# EAGLE design Spring2020 (EAGLE 9.6.2)
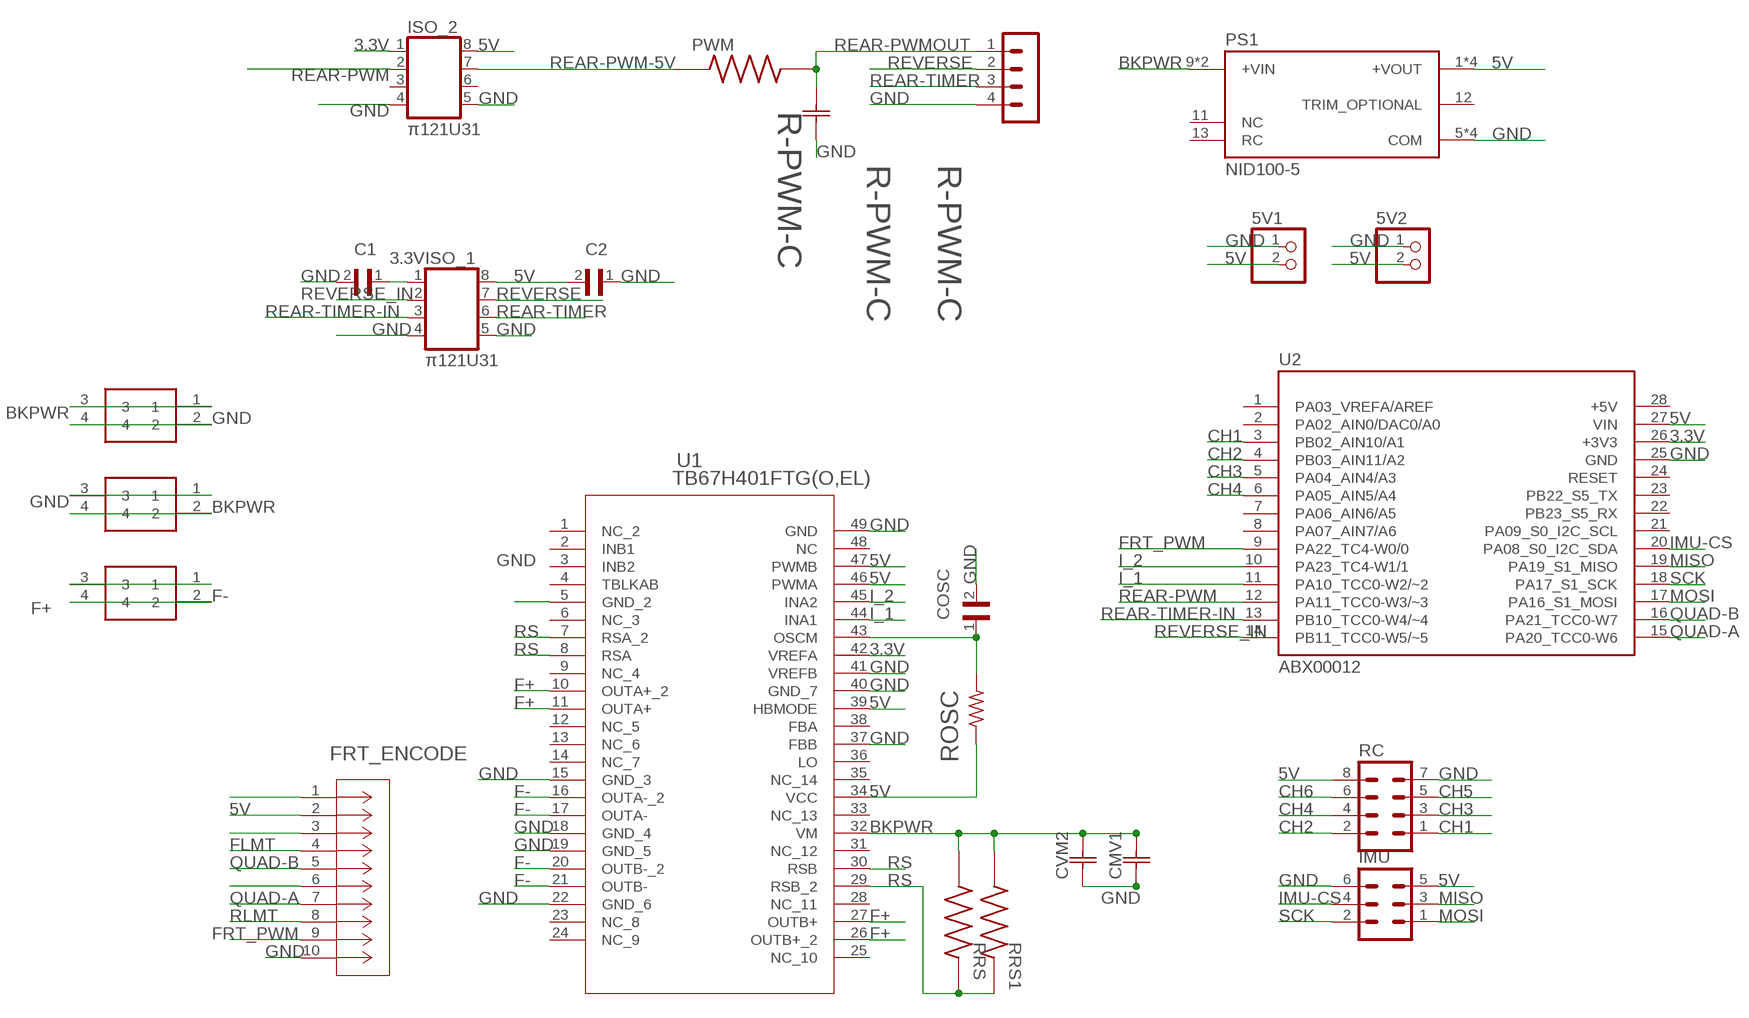
[diagram p0: schematic, sheet 1]

## Parts
5V1  PINHD-1X2  [1X02]
5V2  PINHD-1X2  [1X02]
C1  CL05A105KP5NNNC  [CAPC1005X55N]
C2  CL05A105KP5NNNC  [CAPC1005X55N]
CMV1  UVY1H102MHD  [CAP_12.5_X_25_NCH]
COSC  GRM022R71A271KA01L  [CAPC0402X22N]
CVM2  CL05B104KB54PNC  [CAP_CL_05_SAM]
FRT_ENCODE  3220-10-0100-00  [CONN_3220-10-0100-00_CNC]
FRT_MTR  2060-452_998-404  [2060452998404]
IMU  MA03-2  [MA03-2]
ISO_1  π121U31  [SO08]
ISO_2  π121U31  [SO08]
PS1  NID100-5  [CONV_NID100-5]
PWM  ERJ1GNF6802C  [RES_ERJ1GNF6802C]
PWR_IN  2060-452_998-404  [2060452998404]
R-PWM-C  CL03A105MQ3CSNC  [CAP_CL03_SAM]
RC  MA04-2  [MA04-2]
REAR-MOTOR  MA04-1  [MA04-1]
REAR_PWR  2060-452_998-404  [2060452998404]
ROSC  R-US_R0402  [R0402]
RRS  RLP73K3AR22FTDF  [RESC6331X70N]
RRS1  RLP73K3AR22FTDF  [RESC6331X70N]
U1  TB67H401FTG(O,EL)  [P-VQFN48-0707-0P50-004_TOS]
U2  ABX00012  [ARDUINO_ABX00012]

## Nets
3.3V: C1.1 ISO_1.1 ISO_2.1 U1.42(VREFA) U2.26(+3V3)
5V: 5V1.2 5V2.2 C2.2 FRT_ENCODE.2 IMU.5 ISO_1.8 ISO_2.8 PS1.1(+VOUT) PS1.2(+VOUT) PS1.3(+VOUT) PS1.4(+VOUT) RC.8 ROSC.1 U1.34(VCC) U1.39(HBMODE) U1.46(PWMA) U1.47(PWMB) U2.27(VIN)
BKPWR: CMV1.2 CVM2.2 PS1.9(+VIN) PS1.10(+VIN) PWR_IN.1 PWR_IN.3 REAR_PWR.2 REAR_PWR.4 RRS1.1 RRS.1 U1.32(VM)
CH1: RC.1 U2.3(PB02_AIN10/A1)
CH2: RC.2 U2.4(PB03_AIN11/A2)
CH3: RC.3 U2.5(PA04_AIN4/A3)
CH4: RC.4 U2.6(PA05_AIN5/A4)
CH5: RC.5
CH6: RC.6
F+: FRT_MTR.2 FRT_MTR.4 U1.10(OUTA+_2) U1.11(OUTA+) U1.26(OUTB+_2) U1.27(OUTB+)
F-: FRT_MTR.1 FRT_MTR.3 U1.16(OUTA-_2) U1.17(OUTA-) U1.20(OUTB-_2) U1.21(OUTB-)
FLMT: FRT_ENCODE.4
FRT_PWM: FRT_ENCODE.9 U2.9(PA22_TC4-W0/0)
GND: 5V1.1 5V2.1 C1.2 C2.1 CMV1.1 COSC.2 CVM2.1 FRT_ENCODE.10 IMU.6 ISO_1.4 ISO_1.5 ISO_2.4 ISO_2.5 PS1.5(COM) PS1.6(COM) PS1.7(COM) PS1.8(COM) PWR_IN.2 PWR_IN.4 R-PWM-C.2 RC.7 REAR-MOTOR.4 REAR_PWR.1 REAR_PWR.3 U1.5(GND_2) U1.15(GND_3) U1.18(GND_4) U1.19(GND_5) U1.22(GND_6) U1.37(FBB) U1.40(GND_7) U1.41(VREFB) U1.49(GND) U2.25(GND)
I_1: U1.44(INA1) U2.11(PA10_TCC0-W2/~2)
I_2: U1.45(INA2) U2.10(PA23_TC4-W1/1)
IMU-CS: IMU.4 U2.20(PA08_S0_I2C_SDA)
MISO: IMU.3 U2.19(PA19_S1_MISO)
MOSI: IMU.1 U2.17(PA16_S1_MOSI)
N$1: FRT_ENCODE.3
N$2: FRT_ENCODE.1
N$8: FRT_ENCODE.6
OSCM: COSC.1 ROSC.2 U1.43(OSCM)
QUAD-A: FRT_ENCODE.7 U2.15(PA20_TCC0-W6)
QUAD-B: FRT_ENCODE.5 U2.16(PA21_TCC0-W7)
REAR-PWM: ISO_2.2 U2.12(PA11_TCC0-W3/~3)
REAR-PWM-5V: ISO_2.7 PWM.1
REAR-PWMOUT: PWM.2 R-PWM-C.1 REAR-MOTOR.1
REAR-TIMER: ISO_1.6 REAR-MOTOR.3
REAR-TIMER-IN: ISO_1.3 U2.13(PB10_TCC0-W4/~4)
REVERSE: ISO_1.7 REAR-MOTOR.2
REVERSE_IN: ISO_1.2 U2.14(PB11_TCC0-W5/~5)
RLMT: FRT_ENCODE.8
RS: RRS1.2 RRS.2 U1.7(RSA_2) U1.8(RSA) U1.29(RSB_2) U1.30(RSB)
SCK: IMU.2 U2.18(PA17_S1_SCK)
Unconnected: ISO_2.3 ISO_2.6 PS1.11(NC) PS1.12(TRIM_OPTIONAL) PS1.13(RC) U1.1(NC_2) U1.2(INB1) U1.3(INB2) U1.4(TBLKAB) U1.6(NC_3) U1.9(NC_4) U1.12(NC_5) U1.13(NC_6) U1.14(NC_7) U1.23(NC_8) U1.24(NC_9) U1.25(NC_10) U1.28(NC_11) U1.31(NC_12) U1.33(NC_13) U1.35(NC_14) U1.36(LO) U1.38(FBA) U1.48(NC) U2.1(PA03_VREFA/AREF) U2.2(PA02_AIN0/DAC0/A0) U2.7(PA06_AIN6/A5) U2.8(PA07_AIN7/A6) U2.21(PA09_S0_I2C_SCL) U2.22(PB23_S5_RX) U2.23(PB22_S5_TX) U2.24(RESET)

## Power pins joined to a net without a drawn wire
+5V: U2.28(+5V)

## Library data of the parts
5V1 5V2 = pinhead:PINHD-1X2: PIN HEADER
C1 C2 = SnapEDA Library:CL05A105KP5NNNC: Capacitor: ceramic; 1uF; 10V; X5R; ±10%; SMD; 0402
CMV1 = Test2:UVY1H102MHD; COPYRIGHT: Copyright (C) 2022 Ultra Librarian. All rights reserved.; DIGI-KEY_PART_NUMBER_1: UVY1H102MHD-ND; DIGI-KEY_PART_NUMBER_2: UVY1H102MHD-NDL; MANUFACTURER_PART_NUMBER: UVY1H102MHD; MFR_NAME: Nichicon
COSC = SnapEDA Library:GRM022R71A271KA01L: SMD Capacitor X7R(EIA) with Capacitance: 270pF Tol. 10%. Rated Voltage: 10Vdc
CVM2 = Test:CL05B104KB54PNC; COPYRIGHT: Copyright (C) 2022 Ultra Librarian. All rights reserved.; DIGI-KEY_PART_NUMBER_1: 1276-CL05B104KB54PNCTR-ND; DIGI-KEY_PART_NUMBER_2: 1276-CL05B104KB54PNCCT-ND; DIGI-KEY_PART_NUMBER_3: 1276-CL05B104KB54PNCDKR-ND; MANUFACTURER_PART_NUMBER: CL05B104KB54PNC; MFR_NAME: Samsung
FRT_ENCODE = SnapEDA Library:3220-10-0100-00; COPYRIGHT: Copyright (C) 2022 Ultra Librarian. All rights reserved.; DIGI-KEY_PART_NUMBER_1: 1175-1627-ND; MANUFACTURER_PART_NUMBER: 3220-10-0100-00; MFR_NAME: CNC Tech
FRT_MTR PWR_IN REAR_PWR = 2060-452_998-404:2060-452_998-404: WAGO - 2060-452/998-404 - TERMINAL BLOCK, WIRE TO BRD, 2POS, 18AWG Source: Datasheet <https://componentsearchengine.com/Datasheets/2/2060-452_998-404.pdf>; DESCRIPTION: WAGO - 2060-452/998-404 - TERMINAL BLOCK, WIRE TO BRD, 2POS, 18AWG; HEIGHT: 4.5mm; MANUFACTURER_NAME: Wago; MANUFACTURER_PART_NUMBER: 2060-452/998-404
IMU = con-lstb:MA03-2: PIN HEADER; OC_FARNELL: unknown; OC_NEWARK: unknown
ISO_1 ISO_2 = SnapEDA Library:π121U31
PS1 = SnapEDA Library:NID100-5: Non-Isolated PoL Module DC DC Converter 1 Output 5V 11A 10.5V - 53V Input; MANUFACTURER: Meanwell; MAXIMUM_PACKAGE_HEIGHT: 27.5mm; PARTREV: 2020-10-20; STANDARD: IPC-7351B
PWM = SnapEDA Library:ERJ1GNF6802C; MANUFACTURER: Panasonic; MAXIMUM_PACKAGE_HEIGHT: 0.23 mm; PARTREV: 3/1/2020; STANDARD: Manufacturer Recommendations
R-PWM-C = Test:CL03A105MQ3CSNC; COPYRIGHT: Copyright (C) 2022 Ultra Librarian. All rights reserved.; DIGI-KEY_PART_NUMBER_1: 1276-1325-2-ND; DIGI-KEY_PART_NUMBER_2: 1276-1325-1-ND; DIGI-KEY_PART_NUMBER_3: 1276-1325-6-ND; MANUFACTURER_PART_NUMBER: CL03A105MQ3CSNC; MFR_NAME: Samsung
RC = con-lstb:MA04-2: PIN HEADER; OC_FARNELL: unknown; OC_NEWARK: unknown
REAR-MOTOR = con-lstb:MA04-1: PIN HEADER; OC_FARNELL: unknown; OC_NEWARK: unknown
ROSC = rcl:R-US_: RESISTOR, American symbol; SPICEPREFIX: R
RRS RRS1 = SnapEDA Library:RLP73K3AR22FTDF: RLP73K 3A R22 1% 1K RL
U1 = Test:TB67H401FTG(O,EL); COPYRIGHT: Copyright (C) 2022 Ultra Librarian. All rights reserved.; DIGI-KEY_PART_NUMBER_1: TB67H401FTG(OEL)TR-ND; DIGI-KEY_PART_NUMBER_2: TB67H401FTG(OEL)CT-ND; DIGI-KEY_PART_NUMBER_3: TB67H401FTG(OEL)DKR-ND; MANUFACTURER_PART_NUMBER: TB67H401FTG(O,EL); MFR_NAME: Toshiba Electronic Devices & Storage Co.
U2 = SnapEDA Library:ABX00012: Mkrzero Brd With Headers Mounted; MANUFACTURER: Arduino; PARTREV: 5; STANDARD: Manufacturer Recommendations

## Board
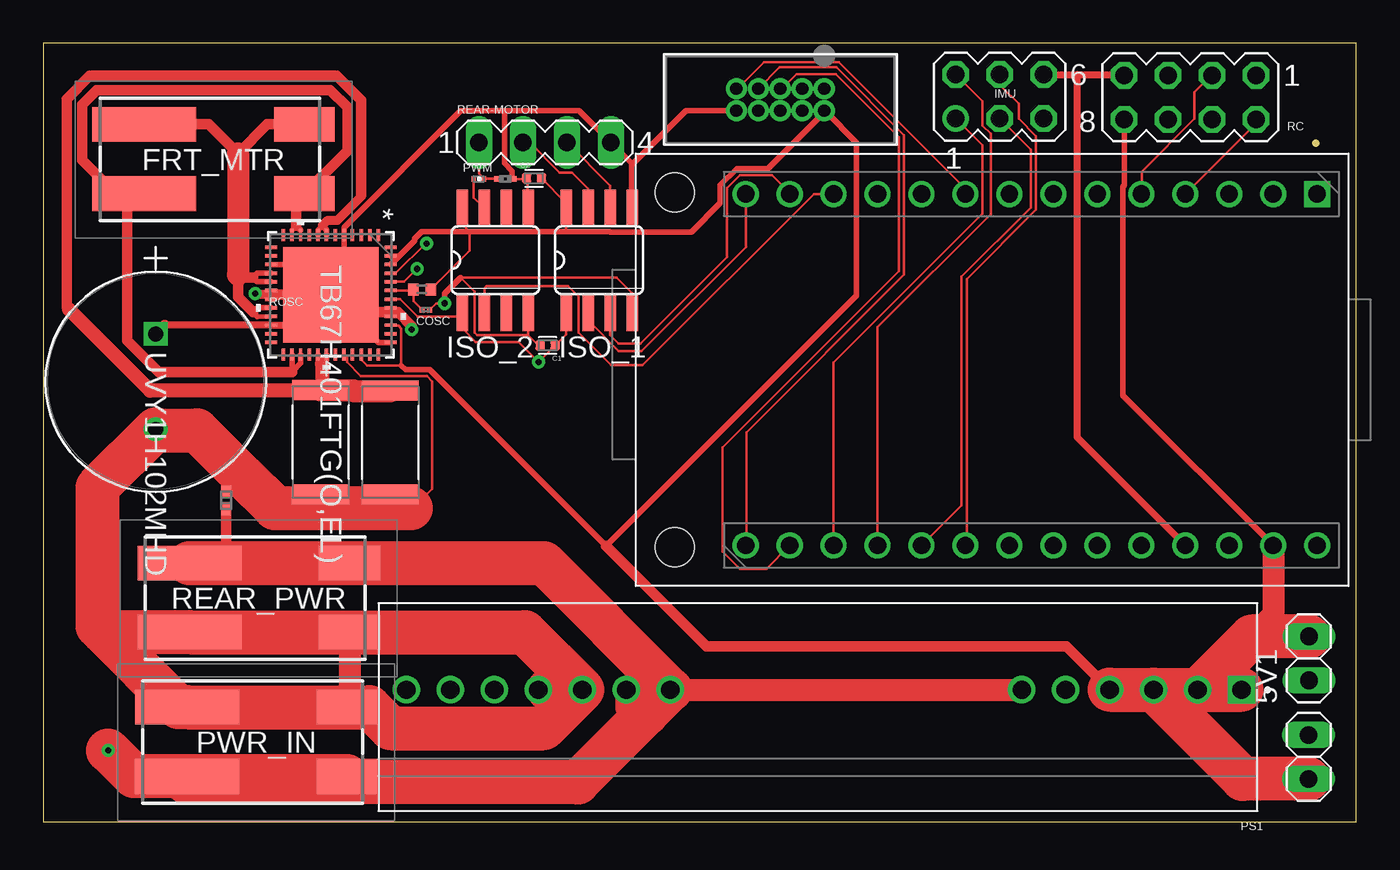
[diagram p1: board, top side]
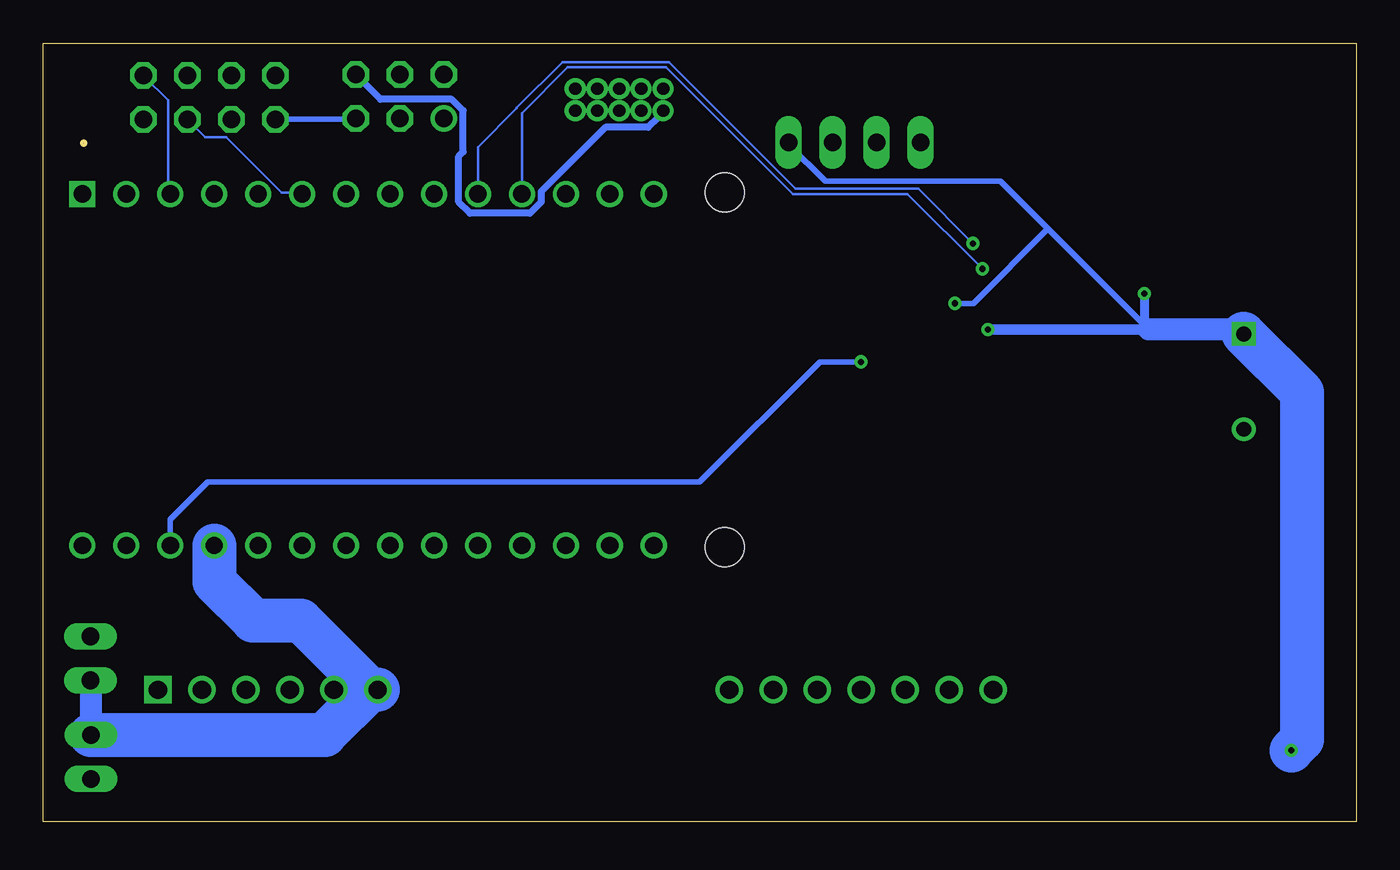
[diagram p2: board, bottom side, seen from below]

Size 75.88 x 45.01 mm. Coordinates in mm from the lower left corner, seen from the top.
Outline: 0,0 75.87,0 75.88,45.01 0.01,45.01 0,0
Copper layers (1*16): Top 0.035mm / dielectric 1.5mm / Bottom 0.035mm
Design rules "default": minimum track width 6mil, minimum drill 0.35mm, track to track 6mil, track to pad 6mil, pad to pad 6mil, via to via 6mil, smd to smd 6mil, copper to edge 40mil, drill to drill 6mil, minimum pad ring 10mil, minimum via ring 8mil, stop-mask expansion 4mil, vias tented up to drill 0mil, thermal gap 10mil

### Footprints (pad centres in the part's own frame; a part is rotated, then mirrored left to right if it is on the bottom)
1X02 = drill 1.016 long: 1 -1.27,0; 2 1.27,0
CAPC1005X55N = smd 0.54 x 0.6: 1 -0.43,0; 2 0.43,0
CAP_12.5_X_25_NCH = drill 0.864 pad 1.372 square: 1 0,0 | drill 0.864 pad 1.372: 2 5.512,0
CAPC0402X22N = smd 0.29 x 0.3: 1 -0.222,0; 2 0.222,0
CAP_CL_05_SAM = smd 0.711 x 0.559: 1 -0.521,0; 2 0.521,0
CONN_3220-10-0100-00_CNC = drill 0.711 pad 1.016: 1 0,0; 2 0,1.27; 3 1.27,0; 4 1.27,1.27; 5 2.54,0; 6 2.54,1.27; 7 3.81,0; 8 3.81,1.27; 9 5.08,0; 10 5.08,1.27
2060452998404 = smd 3.5 x 2: 1 11.808,2; 2 11.808,-2 | smd 6 x 2: 3 2.558,2; 4 2.558,-2
MA03-2 = drill 1.016: 1 -2.54,-1.27 | drill 1.016 octagon: 2 -2.54,1.27; 3 0,-1.27; 4 0,1.27; 5 2.54,-1.27; 6 2.54,1.27
SO08 = smd 0.66 x 2.032: 1 -1.905,-3.073; 2 -0.635,-3.073; 3 0.635,-3.073; 4 1.905,-3.073; 5 1.905,3.073; 6 0.635,3.073; 7 -0.635,3.073; 8 -1.905,3.073
CONV_NID100-5 = drill 1.06 square: 1 0,0 | drill 1.06: 2 2.54,0; 3 5.08,0; 4 7.62,0; 5 10.16,0; 6 12.7,0; 7 33.02,0; 8 35.56,0; 9 38.1,0; 10 40.64,0; 11 43.18,0; 12 45.72,0; 13 48.26,0
RES_ERJ1GNF6802C = smd 0.25 x 0.3: 1 -0.3,0; 2 0.3,0
CAP_CL03_SAM = smd 0.5 x 0.3: 1 -0.4,0; 2 0.4,0
MA04-2 = drill 1.016 octagon: 1 -3.81,-1.27; 2 -3.81,1.27; 3 -1.27,-1.27; 4 -1.27,1.27; 5 1.27,-1.27; 6 1.27,1.27; 7 3.81,-1.27; 8 3.81,1.27
MA04-1 = drill 1.016 long: 1 -3.81,0; 2 -1.27,0; 3 1.27,0; 4 3.81,0
R0402 = smd 0.6 x 0.7: 1 -0.5,0; 2 0.5,0
RESC6331X70N = smd 1.15 x 3.27: 1 -3.013,0; 2 3.013,0
P-VQFN48-0707-0P50-004_TOS = smd 0.705 x 0.199: 1 -3.452,2.75; 2 -3.452,2.25; 3 -3.452,1.75; 4 -3.452,1.25; 5 -3.452,0.75; 6 -3.452,0.25; 7 -3.452,-0.25; 8 -3.452,-0.75; 9 -3.452,-1.25; 10 -3.452,-1.75; 11 -3.452,-2.25; 12 -3.452,-2.75; 25 3.452,-2.75; 26 3.452,-2.25; 27 3.452,-1.75; 28 3.452,-1.25; 29 3.452,-0.75; 30 3.452,-0.25; 31 3.452,0.25; 32 3.452,0.75; 33 3.452,1.25; 34 3.452,1.75; 35 3.452,2.25; 36 3.452,2.75 | smd 0.199 x 0.705: 13 -2.75,-3.452; 14 -2.25,-3.452; 15 -1.75,-3.452; 16 -1.25,-3.452; 17 -0.75,-3.452; 18 -0.25,-3.452; 19 0.25,-3.452; 20 0.75,-3.452; 21 1.25,-3.452; 22 1.75,-3.452; 23 2.25,-3.452; 24 2.75,-3.452; 37 2.75,3.452; 38 2.25,3.452; 39 1.75,3.452; 40 1.25,3.452; 41 0.75,3.452; 42 0.25,3.452; 43 -0.25,3.452; 44 -0.75,3.452; 45 -1.25,3.452; 46 -1.75,3.452; 47 -2.25,3.452; 48 -2.75,3.452 | smd 5.5 x 5.5: 49 0,0
ARDUINO_ABX00012 = drill 1 square: 1 22.135,2.34 | drill 1: 2 24.675,2.34; 3 27.215,2.34; 4 29.755,2.34; 5 32.295,2.34; 6 34.835,2.34; 7 37.375,2.34; 8 39.915,2.34; 9 42.455,2.34; 10 44.995,2.34; 11 47.535,2.34; 12 50.075,2.34; 13 52.615,2.34; 14 55.155,2.34; 15 55.155,22.66; 16 52.615,22.66; 17 50.075,22.66; 18 47.535,22.66; 19 44.995,22.66; 20 42.455,22.66; 21 39.915,22.66; 22 37.375,22.66; 23 34.835,22.66; 24 32.295,22.66; 25 29.755,22.66; 26 27.215,22.66; 27 24.675,22.66; 28 22.135,22.66 | hole 2.25: 59.25,22.75; 59.25,2.25

### Placement (x,y rotation side)
5V1  73.15,9.45 90 top
5V2  73.12,3.75 270 top
C1  29.15,27.54 180 top
C2  28.36,37.2 0 top
CMV1  6.5,28.2 270 top
COSC  22.11,29.6 0 top
CVM2  10.57,18.58 90 top
FRT_ENCODE  45.13,42.38 180 top
FRT_MTR  3.28,38.31 0 top
IMU  55.27,41.92 0 top
ISO_1  32.12,32.47 0 top
ISO_2  26.12,32.47 0 top
PS1  69.25,7.63 180 top
PWM  25.17,37.17 0 top
PWR_IN  5.75,4.63 0 top
R-PWM-C  26.7,37.16 0 top
RC  66.28,41.88 180 top
REAR-MOTOR  28.99,39.27 0 top
REAR_PWR  5.9,12.96 0 top
ROSC  21.89,30.78 180 top
RRS  16.03,21.95 90 top
RRS1  20.05,21.93 90 top
U1  16.62,30.47 270 top
U2  95.75,38.63 180 top

### Tracks (layer width: path | path; a pad name or v marks a point on that pad's centre or on a via)
3.3V  (via drill 0.35)
  Top 0.152: U1.42 20.62,30.22 21.62,29.22 24,29.22 24.12,29.34 24.18,29.37 ISO_2.1 24.22,28.51 24.98,27.74 27.47,27.74 v28.62,26.59 v28.63,26.59 C1.1 30.22,28.18 ISO_1.1
  Bottom 0.305: v28.62,26.59 31,26.59 37.96,19.63 66.38,19.63 68.54,17.47 U2.26
5V
  Top 0.152: PS1.3 PS1.2 66.75,7.63 | U1.34 18.4,27 18.4,26.7 18.7,26.39 20.68,26.39 20.68,28.52 20.53,28.68 20.23,28.68 U1.39 | ISO_1.8 30.22,34.22 30.12,34.12 | ROSC.1 24.62,33.01 24.62,34.12 24.22,34.52 24.25,34.59 24.25,35.47 ISO_2.8 | 30.22,35.76 C2.2 | 32.36,16.12 32.38,16.13 32.52,15.94
  Top 0.305: U1.47 20.58,32.72 | U1.46 20.58,32.72 | U2.27 62.4,24.65 62.4,36.73 62.47,36.81 RC.8 | 45.19,41.07 46.99,39.27 46.99,30.41 32.53,15.95 32.36,16.12 22.33,26.15 20.93,26.15 20.68,26.39 | 45.19,41.07 45.15,41.11 FRT_ENCODE.2 | 20.58,32.72 21.47,33.61 21.47,33.72 21.87,34.12 24.62,34.12 30.12,34.12 32.73,34.12 32.76,34.09 37.45,34.09 39.12,35.76 39.12,36.79 40.09,37.77 41.88,37.77 45.19,41.07
  Top 0.61: PS1.4 59.13,10.13 38.33,10.13 32.52,15.94 | ISO_1.8 30.22,35.76
  Top 1.27: U2.27 71.08,11.96 69.84,10.72
  Top 2.54: PS1.4 PS1.3 | PS1.3 66.75,7.63 | 66.75,7.63 PS1.1 | 5V1.2 69.84,10.72 66.75,7.63 | 5V2.2 69.32,2.48 PS1.3
  Bottom 0.152: 57.85,40.61 IMU.5
  Bottom 0.305: RC.8 57.85,40.61
BKPWR
  Top 0.152: 16.8,18.52 17.23,18.47 17.25,18.47 17.25,18.51 | 17.24,18.62 17.25,18.51 | 17.25,18.51 RRS.1 | 17.63,6.63 17.25,6.63 | CVM2.2 10.63,19.13 11.51,20.01 | U1.32 17.55,26.84 17.55,26.57 18.35,25.77 22.17,25.77 22.48,25.45 22.48,19.24 21.37,18.13 21.25,18.13 20.83,18.13 RRS1.1
  Top 0.61: 16.25,18.13 16.25,18.71 RRS.1
  Top 1.27: PS1.10 PS1.9 | REAR_PWR.2 17.7,7.09 17.25,6.63
  Top 2.54: PS1.9 29.21,7.63 | PS1.9 27.83,10.96 REAR_PWR.4 3.49,10.96 | PS1.9 28.93,5.42 20.07,5.42 18.86,6.63 17.63,6.63 PWR_IN.1 17.25,6.63 PWR_IN.3 7.81,6.63 3.49,10.96 | 3.49,10.96 3.12,11.32 3.12,19.32 CMV1.2 6.56,22.63 8.89,22.63 11.51,20.01 13.39,18.13 16.25,18.13 21.25,18.13
CH1
  Bottom 0.152: U2.3 68.67,36.37 68.67,41.71 70.04,43.08 RC.1
CH2
  Top 0.152: U2.4 66.07,36.37 70.19,40.49 RC.2
CH3
  Top 0.152: U2.5 63.48,36.37 63.48,37.59 66.53,40.64 66.53,42.16 67.45,43.08 RC.3
CH4
  Bottom 0.152: U2.6 61.05,36.37 62.11,36.37 65.31,39.57 66.53,39.57 67.45,40.49 RC.4
F+
  Top 0.152: 14.38,34.22 U1.11 | 14.88,34.22 U1.10 | 5.13,36.72 5.13,36.51 FRT_MTR.4
  Top 0.305: 14.38,34.22 14.62,34.47 14.88,34.22 | U1.27 14.88,26.52 14.38,26.02 U1.26
  Top 0.61: 14.62,34.47 14.62,35.85 FRT_MTR.2 17.59,38.81 17.59,41.3 16.58,42.31 3.08,42.31 2.25,41.47 2.25,38.26 3.79,36.72 5.13,36.72 5.25,36.72 5.35,36.62 | 14.38,26.02 6.67,26.02 4.85,27.83 4.85,36.31 FRT_MTR.4
F-
  Top 0.254: U1.21 12.38,29.22
  Top 0.305: U1.17 12.38,31.22 12.12,31.47 12.38,31.72 U1.16 | U1.20 12.38,29.72 12.12,29.47 12.38,29.22
  Top 0.61: FRT_MTR.3 9.57,40.31 11.25,38.63 12.93,40.31 FRT_MTR.1 | 12.12,29.47 11.25,30.34 11.25,31.63 11.42,31.47 12.12,31.47
  Top 1.27: 11.25,38.63 11.25,31.63
FRT_PWM
  Top 0.152: U2.9 53.3,36.59 45.97,43.91 41.66,43.91 40.13,42.38 FRT_ENCODE.9
GND  (via drill 0.35)
  Top 0.152: 17.38,32.47 17.38,31.22 U1.49 | 18.62,29.22 16.62,29.22 | 16.62,29.22 16.38,29.22 16.12,29.47 | 16.12,28.72 16.62,29.22 | 14.44,30.81 14.45,30.8 14.5,30.84 14.5,30.72 U1.49 | U1.19 13.22,30.2 13.22,30.47 13.22,30.66 U1.18 | 18.7,29.22 18.7,28.52 18.64,28.46 | 56.45,7.72 PS1.6 | 37.4,7.72 PS1.7 | 27.18,37.34 R-PWM-C.2 | 27.86,37.34 C2.1 | C2.1 28,37.09 28,35.59 ISO_2.5 | 28,29.34 ISO_2.4 | 34,29.47 ISO_1.4 34.03,30.56 33.12,31.47 24.12,31.47 24.93,30.66 24.93,28.28 25.06,28.15 28.03,28.15 | 34,35.47 ISO_1.5 34,35.59 | 28.12,29.47 ISO_2.4 | U1.40 20.12,29.22 20.12,29.47 20.12,29.59 U1.41 | 22.33,29.67 COSC.2 22.7,29.97 v23.2,29.97 | 14.38,29.72 13.62,30.47 | 27,37.22 R-PWM-C.2 | ISO_2.4 28.03,28.15 | 28.03,28.15 28.64,27.54 C1.2 | PS1.8 34,7.13 34.87,6.27 | R-PWM-C.2 27.89,37.16 C2.1 | U1.49 14.44,30.47 | 14.38,32.22 14.5,32.13 14.5,30.88 U1.49 | REAR_PWR.1 17.75,15.01 17.75,14.96
  Top 0.305: U1.15 14.38,32.22 | U1.37 19.38,27.72 18.64,28.46 | 17.38,32.47 U1.5 17.38,34.36 24.12,41.1 26.62,41.1 | 19.12,29.72 18.62,29.22 18.7,29.22 | PS1.7 36.25,7.63 | 16.68,30.47 U1.49 16.62,28.59 | 34,37.97 34,38.07 REAR-MOTOR.4 30.97,41.1 26.62,41.1 | 34,37.97 34,35.59 | v23.2,29.97 23.2,30.54 24.12,31.47 | R-PWM-C.2 27.1,37.62 26.65,38.07 26.65,41.08 26.62,41.1 | 34,37.97 37.15,41.11 FRT_ENCODE.10
  Top 0.406: 16.12,28.72 U1.22 7.01,28.72 | IMU.6 59.75,43.19 | 59.75,43.19 62.43,43.19 RC.7 | U2.25 59.75,22.22 59.75,43.19
  Top 0.508: 13.22,30.47 12.32,30.47 v12.25,30.53
  Top 0.61: 14.62,30.47 14.44,30.47 13.62,30.47 13.22,30.47 | CVM2.1 10.57,15.64 11.25,14.96 | 7.01,28.72 CMV1.1 | 18.62,29.22 18.88,29.47 20.12,29.47 20.5,29.47 21.29,28.67 v21.29,28.47
  Top 1.27: PS1.8 33.69,6.59 | 36.25,7.63 PS1.6
  Top 2.54: PS1.7 34.87,6.27 30.88,2.29 8.31,2.29 | REAR_PWR.3 11.25,14.96 REAR_PWR.1 17.75,14.96 28.93,14.96 36.25,7.63 | PWR_IN.2 PWR_IN.4 5.25,2.63 v3.75,4.13
  Bottom 0.305: REAR-MOTOR.4 32.8,39.15 30.67,37.02 20.55,37.02 17.81,34.28 | 17.81,34.28 12,28.47 | v23.2,29.97 22.12,29.97 17.81,34.28
  Bottom 0.406: FRT_ENCODE.10 40.36,40.81 40.36,40.71 40.92,40.15 43.39,40.15 47.11,36.43 47.11,35.83 47.76,35.18 51.22,35.18 51.87,35.83 51.87,38.48 51.61,38.73 51.61,41.12 52.27,41.77 56.39,41.77 IMU.6
  Bottom 0.508: v12.25,30.53 12.25,28.72 12,28.47
  Bottom 0.61: 12,28.47 v21.29,28.47
  Bottom 1.27: 7.08,28.47 12,28.47 | 5V1.1 73.15,5.04 5V2.1 | 57,7.63 PS1.5
  Bottom 2.54: 57,7.63 PS1.6 | U2.25 66,13.88 63.75,11.63 61,11.63 57,7.63 | 5V2.1 59.61,5.02 57,7.63 | CMV1.1 3.12,24.83 3.12,4.76 v3.75,4.13
I_1  (via drill 0.35)
  Top 0.152: v21.61,31.97 20.86,31.22 U1.44
  Bottom 0.152: U2.11 48.22,40.98 45.58,43.61 39.89,43.61 32.56,36.29 25.93,36.29 v21.61,31.97
I_2  (via drill 0.35)
  Top 0.152: v22.15,33.44 22.12,33.47 20.38,31.72 U1.45
  Bottom 0.152: U2.10 50.75,36.38 50.75,39.01 48.52,41.24 48.52,41.27 45.88,43.91 39.72,43.91 32.4,36.59 25.31,36.59 v22.15,33.44
IMU-CS
  Top 0.152: 55.38,42.51 55.38,43.13 IMU.4 55.38,42.51 | 55.38,42.51 56.38,41.51 56.38,40.63 57.38,39.63 57.38,35.38 53.38,31.38 53.38,16.01 U2.20
MISO
  Top 0.152: IMU.3 57.07,38.85 57.07,35.51 53.07,31.51 53.07,18.29 U2.19
MOSI
  Top 0.152: IMU.1 54.28,39.11 54.28,35.16 45.68,26.56 U2.17
OSCM
  Top 0.152: U1.43 21.38,30.72 ROSC.2 21.39,30.09 COSC.1
QUAD-A
  Top 0.152: U2.15 40.63,16.01 40.63,22.51 49.75,31.63 49.75,39.7 45.85,43.61 42.55,43.61 FRT_ENCODE.7
QUAD-B
  Top 0.152: FRT_ENCODE.5 42.68,42.38 43.52,43.22 45.8,43.22 49.45,39.58 49.45,31.83 39.25,21.63 39.25,15.63 40.25,14.63 41.8,14.63 U2.16
REAR-PWM
  Top 0.152: U2.12 44.53,36.29 34.65,26.41 32.8,26.41 30.93,28.28 30.93,30.35 30.32,30.97 25.62,30.97 25.49,30.83 ISO_2.2
REAR-PWM-5V
  Top 0.152: PWM.1 24.88,37.09 24.88,36.09 25.38,35.59 ISO_2.7
REAR-PWMOUT
  Top 0.152: R-PWM-C.1 PWM.2 25.18,37.46 REAR-MOTOR.1
REAR-TIMER
  Top 0.152: REAR-MOTOR.3 32.76,36.77 ISO_1.6
REAR-TIMER-IN
  Top 0.152: U2.13 43.13,36.38 42.13,37.38 40.25,37.38 39.5,36.63 39.5,32.63 34.51,27.64 33.26,27.64 32.76,28.14 ISO_1.3
REVERSE
  Top 0.152: ISO_1.7 31.49,36.6 30.57,37.52 29.85,37.52 28.1,39.27 REAR-MOTOR.2
REVERSE_IN
  Top 0.152: ISO_1.2 31.5,29.34 31.5,28.97 33.25,27.22 34.59,27.22 40.6,33.23 U2.14
RS
  Top 0.152: 16,25.01 16,24.93 16.13,25.01 RRS.2 | RRS1.2 20.13,25.01 20.05,24.9
  Top 0.305: U1.8 15.88,34.22 16.12,34.47 16.38,34.22 U1.7 | U1.29 15.88,26.72 16.11,26.49 16.12,26.47 16.38,26.72 U1.30
  Top 0.508: 16.12,34.47 16.44,34.78 17.01,34.78 18.37,36.14 18.37,36.24
  Top 0.61: 16,24.93 16.11,24.93 | 16.11,24.86 RRS.2 | 18.37,36.24 18.37,41.7 16.95,43.12 2.7,43.12 1.35,41.78 1.35,29.76 1.47,29.63
  Top 0.813: 16.11,26.49 16.11,24.93 | 16,24.93 6.18,24.93 1.47,29.63
  Top 1.016: 16.13,24.9 16.11,24.93
  Top 1.27: RRS.2 17.93,24.96 17.99,24.9 20.05,24.9
SCK
  Top 0.152: U2.18 48.22,28.6 54.75,35.13 54.75,39.77 54.28,40.24 54.28,41.65 IMU.2